# EAGLE schematic Blinker_06 (EAGLE 6.6.0)
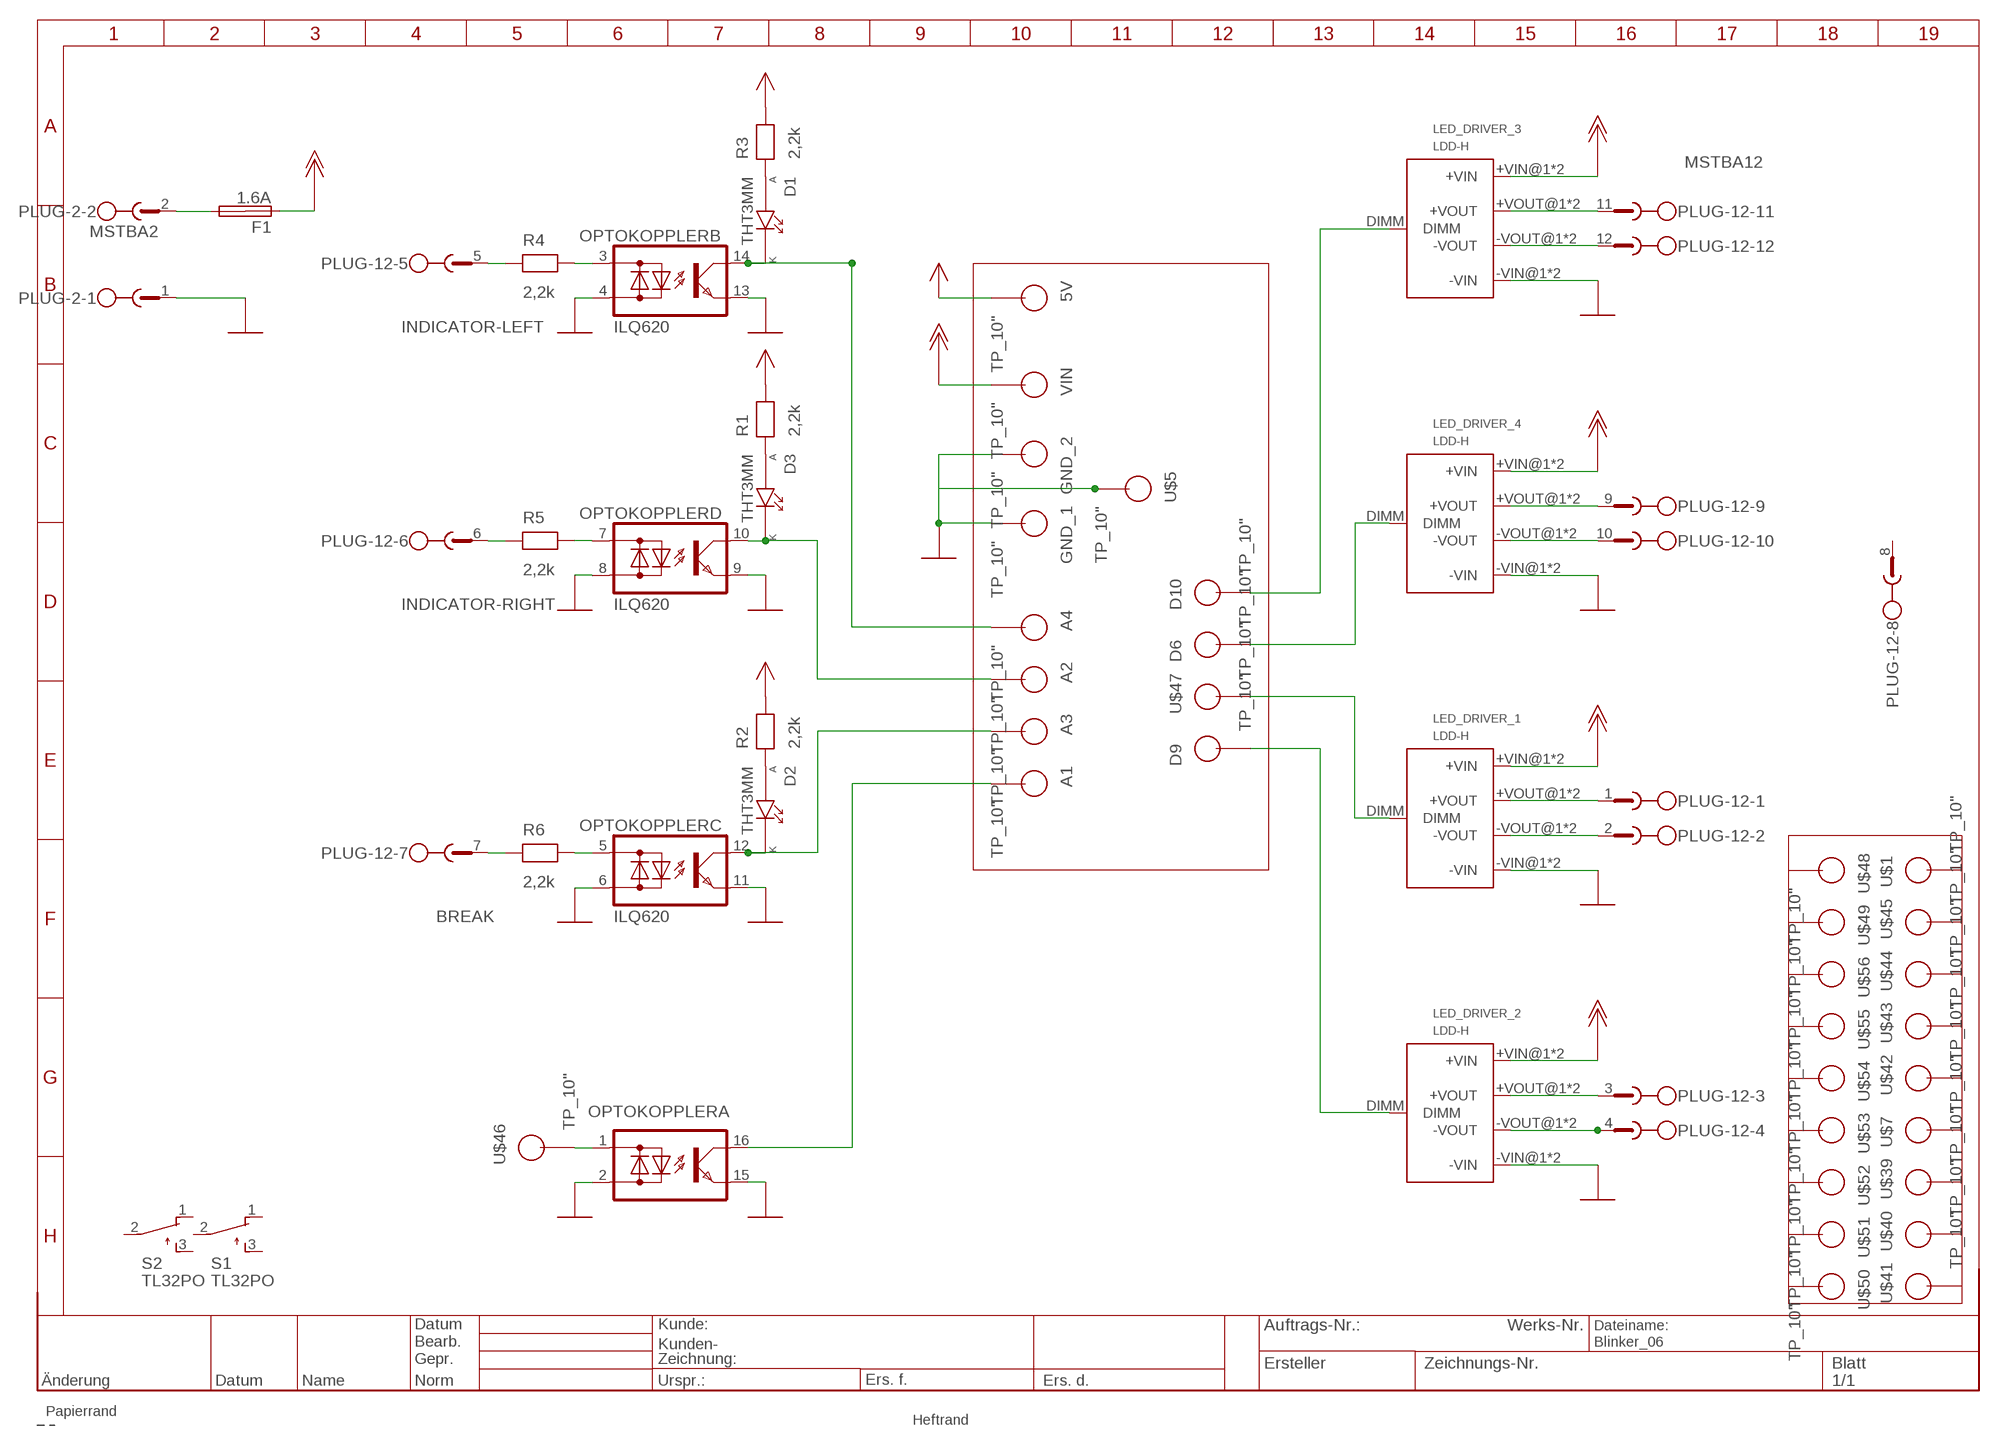
[diagram p0: schematic, sheet 1]

## Parts
5V  TP_10"  [TP_10]
A1  TP_10"  [TP_10]
A2  TP_10"  [TP_10]
A3  TP_10"  [TP_10]
A4  TP_10"  [TP_10]
D1  THT3MM  [THT3MM]
D2  THT3MM  [THT3MM]
D3  THT3MM  [THT3MM]
D6  TP_10"  [TP_10]
D9  TP_10"  [TP_10]
D10  TP_10"  [TP_10]
F1  1.6A  SHK20Q  [SHK20Q]
GND_1  TP_10"  [TP_10]
GND_2  TP_10"  [TP_10]
LED_DRIVER_1  LDD-H  [LDD-H]
LED_DRIVER_2  LDD-H  [LDD-H]
LED_DRIVER_3  LDD-H  [LDD-H]
LED_DRIVER_4  LDD-H  [LDD-H]
OPTOKOPPLER  ILQ620  [DIL16]
PLUG-2  MSTBA2  [MSTBA2]
PLUG-12  MSTBA12  [MSTBA12]
R1  2,2k  RESEU-10  [R-10]
R2  2,2k  RESEU-10  [R-10]
R3  2,2k  RESEU-10  [R-10]
R4  2,2k  RESEU-10  [R-10]
R5  2,2k  RESEU-10  [R-10]
R6  2,2k  RESEU-10  [R-10]
S1  TL32PO  [TL3XPO]
S2  TL32PO  [TL3XPO]
U$1  TP_10"  [TP_10]
U$5  TP_10"  [TP_10]
U$7  TP_10"  [TP_10]
U$39  TP_10"  [TP_10]
U$40  TP_10"  [TP_10]
U$41  TP_10"  [TP_10]
U$42  TP_10"  [TP_10]
U$43  TP_10"  [TP_10]
U$44  TP_10"  [TP_10]
U$45  TP_10"  [TP_10]
U$46  TP_10"  [TP_10]
U$47  TP_10"  [TP_10]
U$48  TP_10"  [TP_10]
U$49  TP_10"  [TP_10]
U$50  TP_10"  [TP_10]
U$51  TP_10"  [TP_10]
U$52  TP_10"  [TP_10]
U$53  TP_10"  [TP_10]
U$54  TP_10"  [TP_10]
U$55  TP_10"  [TP_10]
U$56  TP_10"  [TP_10]
VIN  TP_10"  [TP_10]

## Nets
+5V: 5V.P$1(TP_13) R1.2 R2.2 R3.2
+12V: F1.1A LED_DRIVER_1.+VIN@1(+VIN) LED_DRIVER_1.+VIN@2(+VIN) LED_DRIVER_2.+VIN@1(+VIN) LED_DRIVER_2.+VIN@2(+VIN) LED_DRIVER_3.+VIN@1(+VIN) LED_DRIVER_3.+VIN@2(+VIN) LED_DRIVER_4.+VIN@1(+VIN) LED_DRIVER_4.+VIN@2(+VIN) VIN.P$1(TP_13)
BLAULICHT: LED_DRIVER_2.-VOUT@1(-VOUT) LED_DRIVER_2.-VOUT@2(-VOUT) PLUG-12.4
BLUE-LED: D6.P$1(TP_13) LED_DRIVER_4.DIMM
BREAK: PLUG-12.7 R6.1
BREAK-LED: D10.P$1(TP_13) LED_DRIVER_3.DIMM
GND: GND_1.P$1(TP_13) GND_2.P$1(TP_13) LED_DRIVER_1.-VIN@1(-VIN) LED_DRIVER_1.-VIN@2(-VIN) LED_DRIVER_2.-VIN@1(-VIN) LED_DRIVER_2.-VIN@2(-VIN) LED_DRIVER_3.-VIN@1(-VIN) LED_DRIVER_3.-VIN@2(-VIN) LED_DRIVER_4.-VIN@1(-VIN) LED_DRIVER_4.-VIN@2(-VIN) OPTOKOPPLER.2(A:AC2) OPTOKOPPLER.4(B:AC2) OPTOKOPPLER.6(C:AC2) OPTOKOPPLER.8(D:AC2) OPTOKOPPLER.9(D:E) OPTOKOPPLER.11(C:E) OPTOKOPPLER.13(B:E) OPTOKOPPLER.15(A:E) PLUG-2.1 U$5.P$1(TP_13)
INDICATOR-LEFT: PLUG-12.5 R4.1
INDICATOR-RIGHT: PLUG-12.6 R5.1
LED_2: D1.A(P1A) R3.1
LEFT-LED: LED_DRIVER_1.DIMM U$47.P$1(TP_13)
N$1: F1.2A PLUG-2.2
N$2: D3.A(P1A) R1.1
N$4: A3.P$1(TP_13) D2.K(P2K) OPTOKOPPLER.12(C:C)
N$5: OPTOKOPPLER.1(A:AC1) U$46.P$1(TP_13)
N$10: A1.P$1(TP_13) OPTOKOPPLER.16(A:C)
N$11: OPTOKOPPLER.7(D:AC1) R5.2
N$14: LED_DRIVER_1.+VOUT@1(+VOUT) LED_DRIVER_1.+VOUT@2(+VOUT) PLUG-12.1
N$15: LED_DRIVER_1.-VOUT@1(-VOUT) LED_DRIVER_1.-VOUT@2(-VOUT) PLUG-12.2
N$16: LED_DRIVER_2.+VOUT@1(+VOUT) LED_DRIVER_2.+VOUT@2(+VOUT) PLUG-12.3
N$17: LED_DRIVER_3.-VOUT@1(-VOUT) LED_DRIVER_3.-VOUT@2(-VOUT) PLUG-12.12
N$18: LED_DRIVER_3.+VOUT@1(+VOUT) LED_DRIVER_3.+VOUT@2(+VOUT) PLUG-12.11
N$19: LED_DRIVER_4.-VOUT@1(-VOUT) LED_DRIVER_4.-VOUT@2(-VOUT) PLUG-12.10
N$20: D2.A(P1A) R2.1
N$21: LED_DRIVER_4.+VOUT@1(+VOUT) LED_DRIVER_4.+VOUT@2(+VOUT) PLUG-12.9
N$22: OPTOKOPPLER.5(C:AC1) R6.2
N$24: OPTOKOPPLER.3(B:AC1) R4.2
RIGHT-LED: D9.P$1(TP_13) LED_DRIVER_2.DIMM
SCH_LI_3: A2.P$1(TP_13) D3.K(P2K) OPTOKOPPLER.10(D:C)
SCH_RE_3: A4.P$1(TP_13) D1.K(P2K) OPTOKOPPLER.14(B:C)
Unconnected: F1.1B F1.2B PLUG-12.8 S1.1(O) S1.2(P) S1.3(S) S2.1(O) S2.2(P) S2.3(S) U$1.P$1(TP_13) U$7.P$1(TP_13) U$39.P$1(TP_13) U$40.P$1(TP_13) U$41.P$1(TP_13) U$42.P$1(TP_13) U$43.P$1(TP_13) U$44.P$1(TP_13) U$45.P$1(TP_13) U$48.P$1(TP_13) U$49.P$1(TP_13) U$50.P$1(TP_13) U$51.P$1(TP_13) U$52.P$1(TP_13) U$53.P$1(TP_13) U$54.P$1(TP_13) U$55.P$1(TP_13) U$56.P$1(TP_13)

## Library data of the parts
5V A1-A4 D6 D9 D10 GND_1 GND_2 U$1 U$5 U$7 U$39-U$56 VIN = SUPPLY:TP_10
D1-D3 = LED:THT3MM
F1 = fuse:SHK20Q: FUSE HOLDER 5 x 20 mm, SH contact, E1207 Buerklin 64G6061; OC_FARNELL: unknown; OC_NEWARK: unknown
LED_DRIVER_1-LED_DRIVER_4 = SPEZIAL:LDD-H
OPTOKOPPLER = optocoupler:ILQ620: SIEMENS OPTO COUPLER
PLUG-2 = con-phoenix-508:MSTBA2: PHOENIX; MF: FARNELL; MPN: 1757242; OC_FARNELL: 3705171; OC_NEWARK: 71C4161
PLUG-12 = con-phoenix-508:MSTBA12: PHOENIX; MPN: 1757349; OC_FARNELL: 3705250; OC_NEWARK: 71C4169
R1-R6 = R-C:RESEU-10
S1 S2 = switch:TL32PO: TINY SWITCH ON - MOM Source: http://www2.produktinfo.conrad.com/datenblaetter/700000-724999/705152-da-01-de-Subminiaturschalter_TL_36YO.pdf